# Altium project ESP32_INDUSTRIAL_IO_BASEBOARD.PrjPcb (part 2 of 2)

## Sheet EtherCAT.SchDoc
size B
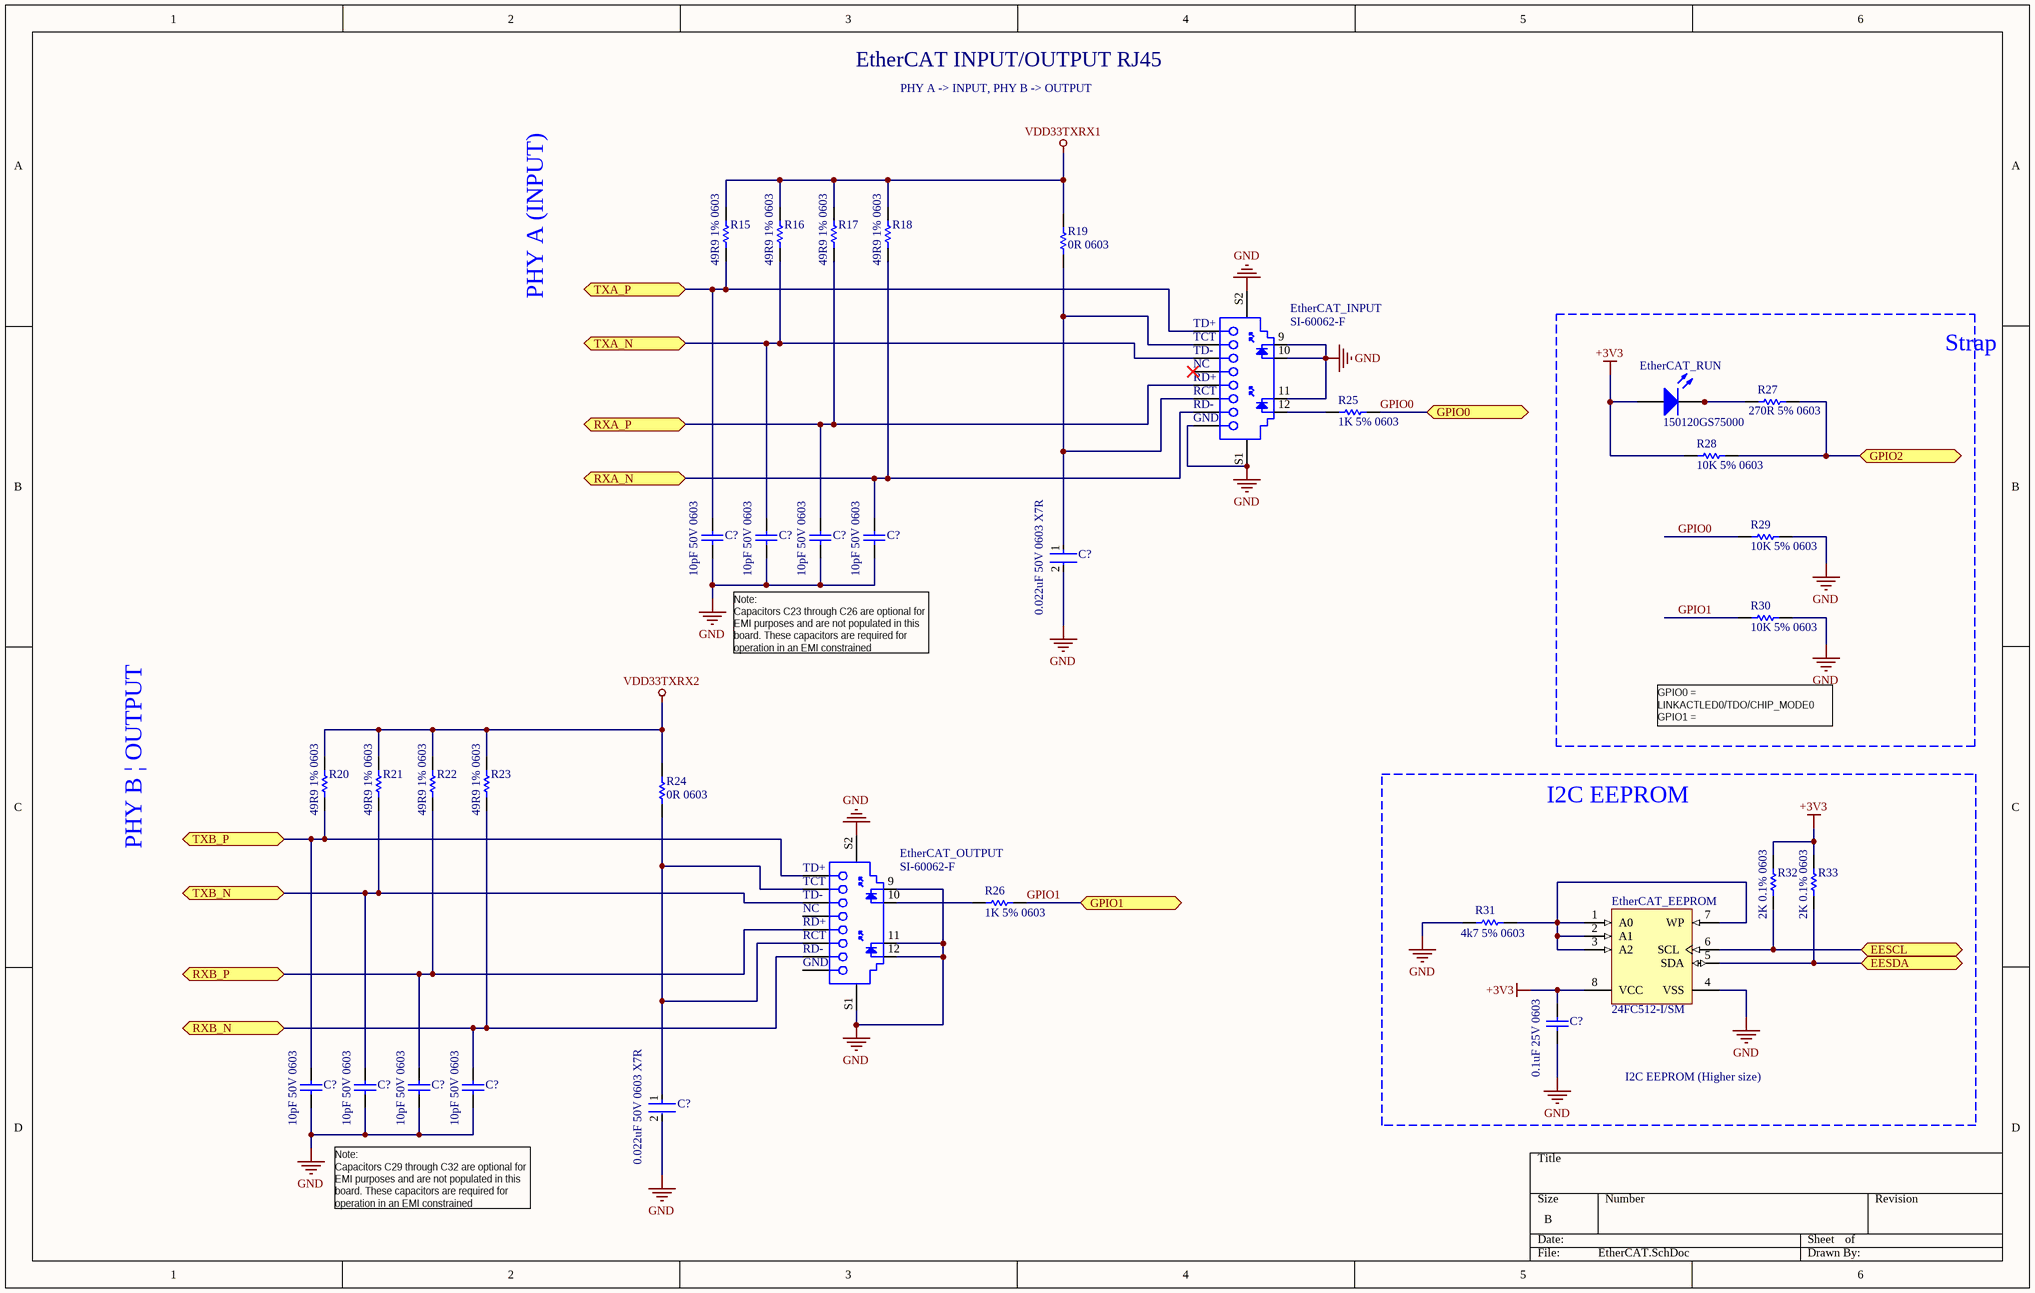
[diagram p5: EtherCAT.SchDoc]

### Parts
(Parts that share a designator on the sheet are numbered #1, #2 ... from top to bottom, then left to right.)
C?#1  10pF 50V 0603  [CAPC1608X90X35LL10T15]
C?#2  10pF 50V 0603  [CAPC1608X90X35LL10T15]
C?#3  10pF 50V 0603  [CAPC1608X90X35LL10T15]
C?#4  10pF 50V 0603  [CAPC1608X90X35LL10T15]
C?#5  0.022uF 50V 0603 X7R  [FP-C0603C-CF-MFG]
C?#6  0.1uF 25V 0603  [CAPC1608X90X35LL10T15]
C?#7  10pF 50V 0603  [CAPC1608X90X35LL10T15]
C?#8  10pF 50V 0603  [CAPC1608X90X35LL10T15]
C?#9  10pF 50V 0603  [CAPC1608X90X35LL10T15]
C?#10  10pF 50V 0603  [CAPC1608X90X35LL10T15]
C?#11  0.022uF 50V 0603 X7R  [FP-C0603C-CF-MFG]
EtherCAT_EEPROM  24FC512-I/SM  [SOIJ-SM8_M]
EtherCAT_INPUT  SI-60062-F  [BELF-SI-60062-F_V]
EtherCAT_OUTPUT  SI-60062-F  [BELF-SI-60062-F_V]
EtherCAT_RUN  150120GS75000  [1206_A]
R15  49R9 1% 0603  [RESC1608X55X25NL10T15]
R16  49R9 1% 0603  [RESC1608X55X25NL10T15]
R17  49R9 1% 0603  [RESC1608X55X25NL10T15]
R18  49R9 1% 0603  [RESC1608X55X25NL10T15]
R19  0R 0603  [RESC1608X55X25ML10T15]
R20  49R9 1% 0603  [RESC1608X55X25NL10T15]
R21  49R9 1% 0603  [RESC1608X55X25NL10T15]
R22  49R9 1% 0603  [RESC1608X55X25NL10T15]
R23  49R9 1% 0603  [RESC1608X55X25NL10T15]
R24  0R 0603  [RESC1608X55X25ML10T15]
R25  1K 5% 0603  [RESC1608X55X25NL10T15]
R26  1K 5% 0603  [RESC1608X55X25NL10T15]
R27  270R 5% 0603  [RESC1608X55X25LL10T15]
R28  10K 5% 0603  [RESC1608X55X25ML10T15]
R29  10K 5% 0603  [RESC1608X55X25ML10T15]
R30  10K 5% 0603  [RESC1608X55X25ML10T15]
R31  4k7 5% 0603  [RESC1608X55X25ML10T15]
R32  2K 0.1% 0603  [RESC1608X55X25ML10T15]
R33  2K 0.1% 0603  [RESC1608X55X25ML10T15]

### Blocks framed on the sheet
Strap: EtherCAT_RUN R27-R30
I2C EEPROM: C?#6 EtherCAT_EEPROM R31-R33

### Ports
EESCL (bidir), EESDA (bidir), GPIO0 (bidir), GPIO1 (bidir), GPIO2 (bidir), RXA_N (bidir), RXA_P (bidir), RXB_N (bidir), RXB_P (bidir), TXA_N (bidir), TXA_P (bidir), TXB_N (bidir), TXB_P (bidir)

### Nets
+3V3: C?#6.2 EtherCAT_EEPROM.8(VCC) EtherCAT_RUN.2(A) R28.2 R32.2 R33.2
GND: C?#1.1 C?#2.1 C?#3.1 C?#4.1 C?#5.2 C?#6.1 C?#7.1 C?#8.1 C?#9.1 C?#10.1 C?#11.2 EtherCAT_EEPROM.4(VSS) EtherCAT_INPUT.8(GND) EtherCAT_INPUT.9 EtherCAT_INPUT.10 EtherCAT_INPUT.11 EtherCAT_INPUT.S1 EtherCAT_INPUT.S2 EtherCAT_OUTPUT.9 EtherCAT_OUTPUT.11 EtherCAT_OUTPUT.12 EtherCAT_OUTPUT.S1 EtherCAT_OUTPUT.S2 R29.1 R30.1 R31.1
VDD33TXRX1: R15.2 R16.2 R17.2 R18.2 R19.2
VDD33TXRX2: R20.2 R21.2 R22.2 R23.2 R24.2
GPIO0: R25.2 R29.2 ; port GPIO0
GPIO1: R26.2 R30.2 ; port GPIO1
RXA_N: C?#4.2 EtherCAT_INPUT.7(RD-) R18.1 ; port RXA_N
RXA_P: C?#3.2 EtherCAT_INPUT.5(RD+) R17.1 ; port RXA_P
RXB_N: C?#10.2 EtherCAT_OUTPUT.7(RD-) R23.1 ; port RXB_N
RXB_P: C?#9.2 EtherCAT_OUTPUT.5(RD+) R22.1 ; port RXB_P
TXA_N: C?#2.2 EtherCAT_INPUT.3(TD-) R16.1 ; port TXA_N
TXA_P: C?#1.2 EtherCAT_INPUT.1(TD+) R15.1 ; port TXA_P
TXB_N: C?#8.2 EtherCAT_OUTPUT.3(TD-) R21.1 ; port TXB_N
TXB_P: C?#7.2 EtherCAT_OUTPUT.1(TD+) R20.1 ; port TXB_P
NetC?#5_1: C?#5.1 EtherCAT_INPUT.2(TCT) EtherCAT_INPUT.6(RCT) R19.1
NetC?#11_1: C?#11.1 EtherCAT_OUTPUT.2(TCT) EtherCAT_OUTPUT.6(RCT) R24.1
NetEtherCAT_EEPROM_1: EtherCAT_EEPROM.1(A0) EtherCAT_EEPROM.2(A1) EtherCAT_EEPROM.3(A2) EtherCAT_EEPROM.7(WP) R31.2
NetEtherCAT_EEPROM_5: EtherCAT_EEPROM.5(SDA) R33.1 ; port EESDA
NetEtherCAT_EEPROM_6: EtherCAT_EEPROM.6(SCL) R32.1 ; port EESCL
NetEtherCAT_INPUT_12: EtherCAT_INPUT.12 R25.1
NetEtherCAT_OUTPUT_10: EtherCAT_OUTPUT.10 R26.1
NetEtherCAT_RUN_1: EtherCAT_RUN.1(K) R27.1
NetR27_2: R27.2 R28.1 ; port GPIO2

Not connected (* = marked no-connect by the designer): EtherCAT_INPUT 4(NC)*; EtherCAT_OUTPUT 4(NC) 8(GND)

### Notes on the sheet
- EtherCAT INPUT/OUTPUT RJ45
- PHY A -> INPUT, PHY B -> OUTPUT
- PHY A (INPUT)
- (near C?#2) Note:
  Capacitors C23 through C26 are optional for EMI purposes and are not populated in this  board. These capacitors are required for operation in an EMI constrained environment.
- GPIO0 = LINKACTLED0/TDO/CHIP_MODE0
  GPIO1 = LINKACTLED1/TDI/CHIP_MODE1
  GPIO2 = RUNLED/E2PSIZE
- PHY B | OUTPUT
- I2C EEPROM (Higher size)
- (near C?#8) Note:
  Capacitors C29 through C32 are optional for EMI purposes and are not populated in this  board. These capacitors are required for operation in an EMI constrained environment.

### Library data of the parts
C?#1-C?#4 C?#7-C?#10 = CMP-2006-02592-1: Part Number: GRM1885C1H100JA01D; Manufacturer: Murata
C?#5 C?#11 = CMP-2006-03879-3: Ceramic Capacitor 0.022Uf 50V, X7R, 10%, 0603, Full Reel; Manufacturer Part Number: C0603C223K5RACTU; Manufacturer: KEMET; Automotive Grade: Grade 1; Capacitance: 22,000 pF; Value: 22,000 pF; Tolerance: 0.1; Temperature Coefficient: 30ppm/°C; Material: Ceramic; Mouser Description: Capacitor; Ceramic; Cap; .022uF; Tol+10%; SMT; Vol-Rtg 50V; X7R; TR; Voltage Rating: 50 V; Category: Cap; Device Class L2: Capacitors; RoHS: TRUE; Package: C0603C-CF; Device Class L1: Passive Components; Temperature Range Low: -55°C; Octopart: https://octopart.com/c0603c223k5ractu-kemet-97352; Temperature: -55°C to +125°C; Temperature Range High: +125°C; Automotive: Yes; Lead Free: Yes; ComponentLink2URL: https://api.kemet.com/component-edge/download/datasheet/C0603C100J5GACAUTO.pdf; Temperature Characteristic: X7R; Height: 0.87mm; Device Class L3: Ceramic Capacitors; Digikey Description: Ceramic Capacitor 0.022Uf 50V, X7R, 10%, 0603, Full Reel; ComponentLink2Description: Datasheet
C?#6 = CMP-2006-02868-1: Part Number: GRM188R71E104KA01D; Manufacturer: Murata
EtherCAT_EEPROM = CMP-0159-00532-1: 512Kbit, 1MHz, 2.5V, I2C Serial EEPROM, 8-Pin SOIC 208mil, Industrial Temperature; PackageDescription: 8-Lead Plastic Small Outline (SM) - Medium, 5.28 mm Body [SOIJ]; PackageReference: SOIJ-SM8; PackageVersion: revBB, Aug-2009; DatasheetVersion: revJ, Jul-2008
EtherCAT_INPUT EtherCAT_OUTPUT = CMP-2000-07059-1: 1 Port RJ45 Magjack Connector with Yellow and Green LED, 10/100 Base-T, 12-Pin THD, RoHS, Tray; Manufacturer: Bel Fuse; Number of Ways: 8P4C; Gender: Female; Shield Type: STP; Connector Type: RJ45; Contact Plating: Gold; Mounting Type: ThroughHole; Datasheet Version: Rev. B0, 09/2008; Package Reference: SI-60062-F; Manufacturer URL: http://belfuse.com/; Package Description: 12-Pin Through Hole Device, Body 21.59 x 16.13 mm; Series: MagJack; Contact Material: CopperAlloy; Datasheet URL: http://belfuse.com/pdfs/SI-60062-F.pdf; Width: 17.98mm; Length: 15.21mm; Mounting Technology: ThroughHole; Depth: 21.59mm; Orientation: Straight
EtherCAT_RUN = CMP-1426-00014-1: SMD mono-color Chip LED, WL-SMCW, Green; Manufacturer: Wuerth Elektronik; PackageReference: 1206_A; PartNumber: 150120GS75000; ComponentLink1Description: Manufacturer URL; ComponentLink2URL: http://katalog.we-online.com/led/datasheet/150120GS75000.pdf; ComponentLink2Description: Datasheet; Color: Green; ComponentLink1URL: http://www.we-online.com
R15-R18 R20-R23 = CMP-1659-00036-1: General Purpose Chip Resistor, 49.9 Ohm, +/- 1%, -55 to 155 degC, 0603 (1608 Metric), RoHS, Tape and Reel; Max Supply Voltage: 3.63 V; Case\Package: LQFP; Interface: SPI; Min Supply Voltage: 2.97 V; PackageReference: 0603; Packaging: Tray; ComponentLink2Description: Datasheet; ComponentLink1Description: Manufacturer URL; ComponentLink2URL: https://datasheet.ciiva.com/11808/0900766b80f96399-11808223.pdf; RoHSCompliant: true; Max Operating Temperature: 85 degC; ComponentLink1URL: http://www.yageo.com/; PackageDescription: 2-Pin Surface Mount Device, Body 1.6 x 0.8 mm; DatasheetVersion: Rev. 4, 04/2009; Min Operating Temperature: -40 degC; Package Quantity: 250; Pins: 48
R19 R24 = CMP-2100-03667-1: Chip Resistor, 0 Ohm, +/- 5%, 0.1 W, -55 to 155 degC, 0603 (1608 Metric), RoHS, Tape and Reel; Manufacturer: Yageo; Temperature Coefficient: 200ppm/degreesC; Voltage Rating: 50V; Power Rating: 100mW; Resistance: 0mOhm; Width: 0.8mm; Max Operating Temperature: 155degC; Tolerance: 5%; Package Reference: 0603; Height: 0.45mm; Depth: 0.8mm; Package Description: 2-Pin Surface Mount Device, Body 1.6 x 0.8 mm; Termination: SMD/SMT; Package Quantity: 5000; Case/Package: 0603; Case Code (Imperial): 0603; Radiation Hardening: No; Number of Pins: 2; Length: 1.6mm; Lead Free: LeadFree; Voltage Rating (DC): 50V; Military Standard: Not; Datasheet URL: http://www.yageo.com/NewPortal/yageodocoutput?fileName=/pdf/R-Chip/PYu-RC_Group_51_RoHS_L_5.pdf; Manufacturer URL: http://www.yageo.com/; Packaging: TapeandReel; Case Code (Metric): 1608; Min Operating Temperature: -55degC; Composition: ThickFilm; RoHSCompliant: true; Contact Plating: Tin; Datasheet Version: Rev. 5, 10/2016; REACH SVHC: NoSVHC
R25 R26 = CMP-1659-00009-4: Chip Resistor, 1 KOhm, +/-1%, 0.1 W, -55 to 155 degC, 0603 (1608 Metric), RoHS, Tape and Reel; Manufacturer: Yageo; Voltage Rating: 50 V; ComponentLink2URL: http://www.yageo.com/documents/recent/PYu-RC_Group_51_RoHS_L_04.pdf; Max Operating Temperature: 155 degC; PackageDescription: 2-Pin Surface Mount Device, Body 1.6 x 0.8 mm; Packaging: Tape and Reel; ComponentLink3Description: Package Specification; REACH SVHC: No SVHC; Mount: Surface Mount; ComponentLink2Description: Datasheet; Length: 1.6 mm; PackageReference: 0603; Height: 0.45 mm; DatasheetVersion: Rev. 4, 02/2016; Min Operating Temperature: -55 degC; ComponentLink1Description: Manufacturer URL; Package Quantity: 200; RoHSCompliant: true; ComponentLink3URL: http://www.farnell.com/datasheets/443971.pdf; Pins: 2; Mounting Technology: Surface Mount; ComponentLink1URL: http://www.yageo.com/
R27 = CMP-2000-06956-1: Chip Resistor, 270 Ohm, +/- 5%, 0.1 W, -55 to 155 degC, 0603 (1608 Metric), RoHS, Tape and Reel; Manufacturer: Yageo; Resistor Case Style: 0603[1608Metric]; Resistance: 270ohm; Resistor Element Type: ThickFilm; Voltage Rating: 50V; Temperature Coefficient: ±100ppm/°C; SVHC: ToBeAdvised; Product Range: RCSeries; Power Rating: 100mW; MSL: MSL1-Unlimited; Datasheet URL: http://www.yageo.com/documents/recent/PYu-RC_Group_51_RoHS_L_7.pdf; Packaging: CutTape; Manufacturer URL: http://www.yageo.com/; Automotive Qualification Standard: -; Resistance Tolerance: ±5%; Package Reference: 0603; Package Description: 2-Pin Surface Mount Device, Body 1.6 x 0.8 mm; Mounting Technology: SurfaceMount; Datasheet Version: Rev. 7, 05/2017
R28-R30 = CMP-2100-03664-1: Chip Resistor, 10 KOhm, +/- 1%, 01 W, -55 to 155 degC, 0603 (1608 Metric), RoHS, Tape and Reel; Manufacturer: Yageo; Temperature Coefficient: 100ppm/degreesC; Resistance: 10KOhm; Voltage Rating: 75V; Power Rating: 100mW; Voltage Rating (DC): 50V; Composition: ThickFilm; RoHSCompliant: true; Height: 0.45mm; Lead Free: LeadFree; Case Code (Metric): 1608; Case/Package: 0603; Datasheet Version: Rev. 5, 10/2016; Package Reference: 0603; Depth: 0.8mm; Package Description: 2-Pin Surface Mount Device, Body 1.6 x 0.8 mm; Case Code (Imperial): 0603; Packaging: TapeandReel; Termination: SMD/SMT; Lead Pitch: 0.3mm; Width: 0.8mm; Number of Pins: 2; Length: 1.6mm; REACH SVHC: NoSVHC; Military Standard: Not; Max Operating Temperature: 155degC; Min Operating Temperature: -55degC; Manufacturer URL: http://www.yageo.com/; Datasheet URL: http://www.yageo.com/NewPortal/yageodocoutput?fileName=/pdf/R-Chip/PYu-RC_Group_51_RoHS_L_5.pdf; Weight: 7.1E-05oz; Tolerance: 1%
R31 = CMP-2000-05024-1: Chip Resistor, 4.7 KOhm, +/- 5%, 100 mW, -55 to 155 degC, 0603 (1608 Metric), RoHS, Tape and Reel; Manufacturer: Yageo; Resistance: 4.7kOhms; Temperature Coefficient: 100PPM/C; Power Rating: 100mW; Voltage Rating: 50V; Operating Temperature Range: -55Cto+155C; Case Code - mm: 1608; Tolerance: 5%; Product: ThickFilmResistorsGeneralPurpose; Case Code - in: 0603; Datasheet URL: http://www.yageo.com/documents/recent/PYu-RC_Group_51_RoHS_L_04.pdf; Package Reference: 603; Datasheet Version: Rev. 4, 02/2016; Package Description: 2-Pin Surface Mount Device, Body 1.6 x 0.8 mm; Manufacturer URL: http://www.yageo.com/; Series: RC; Packaging: Reel; Termination Style: SMD/SMT
R32 R33 = CMP-2000-04430-1: Part Number: RT0603BRD072KL; Manufacturer: Yageo

## Sheet CONN.SchDoc
size B
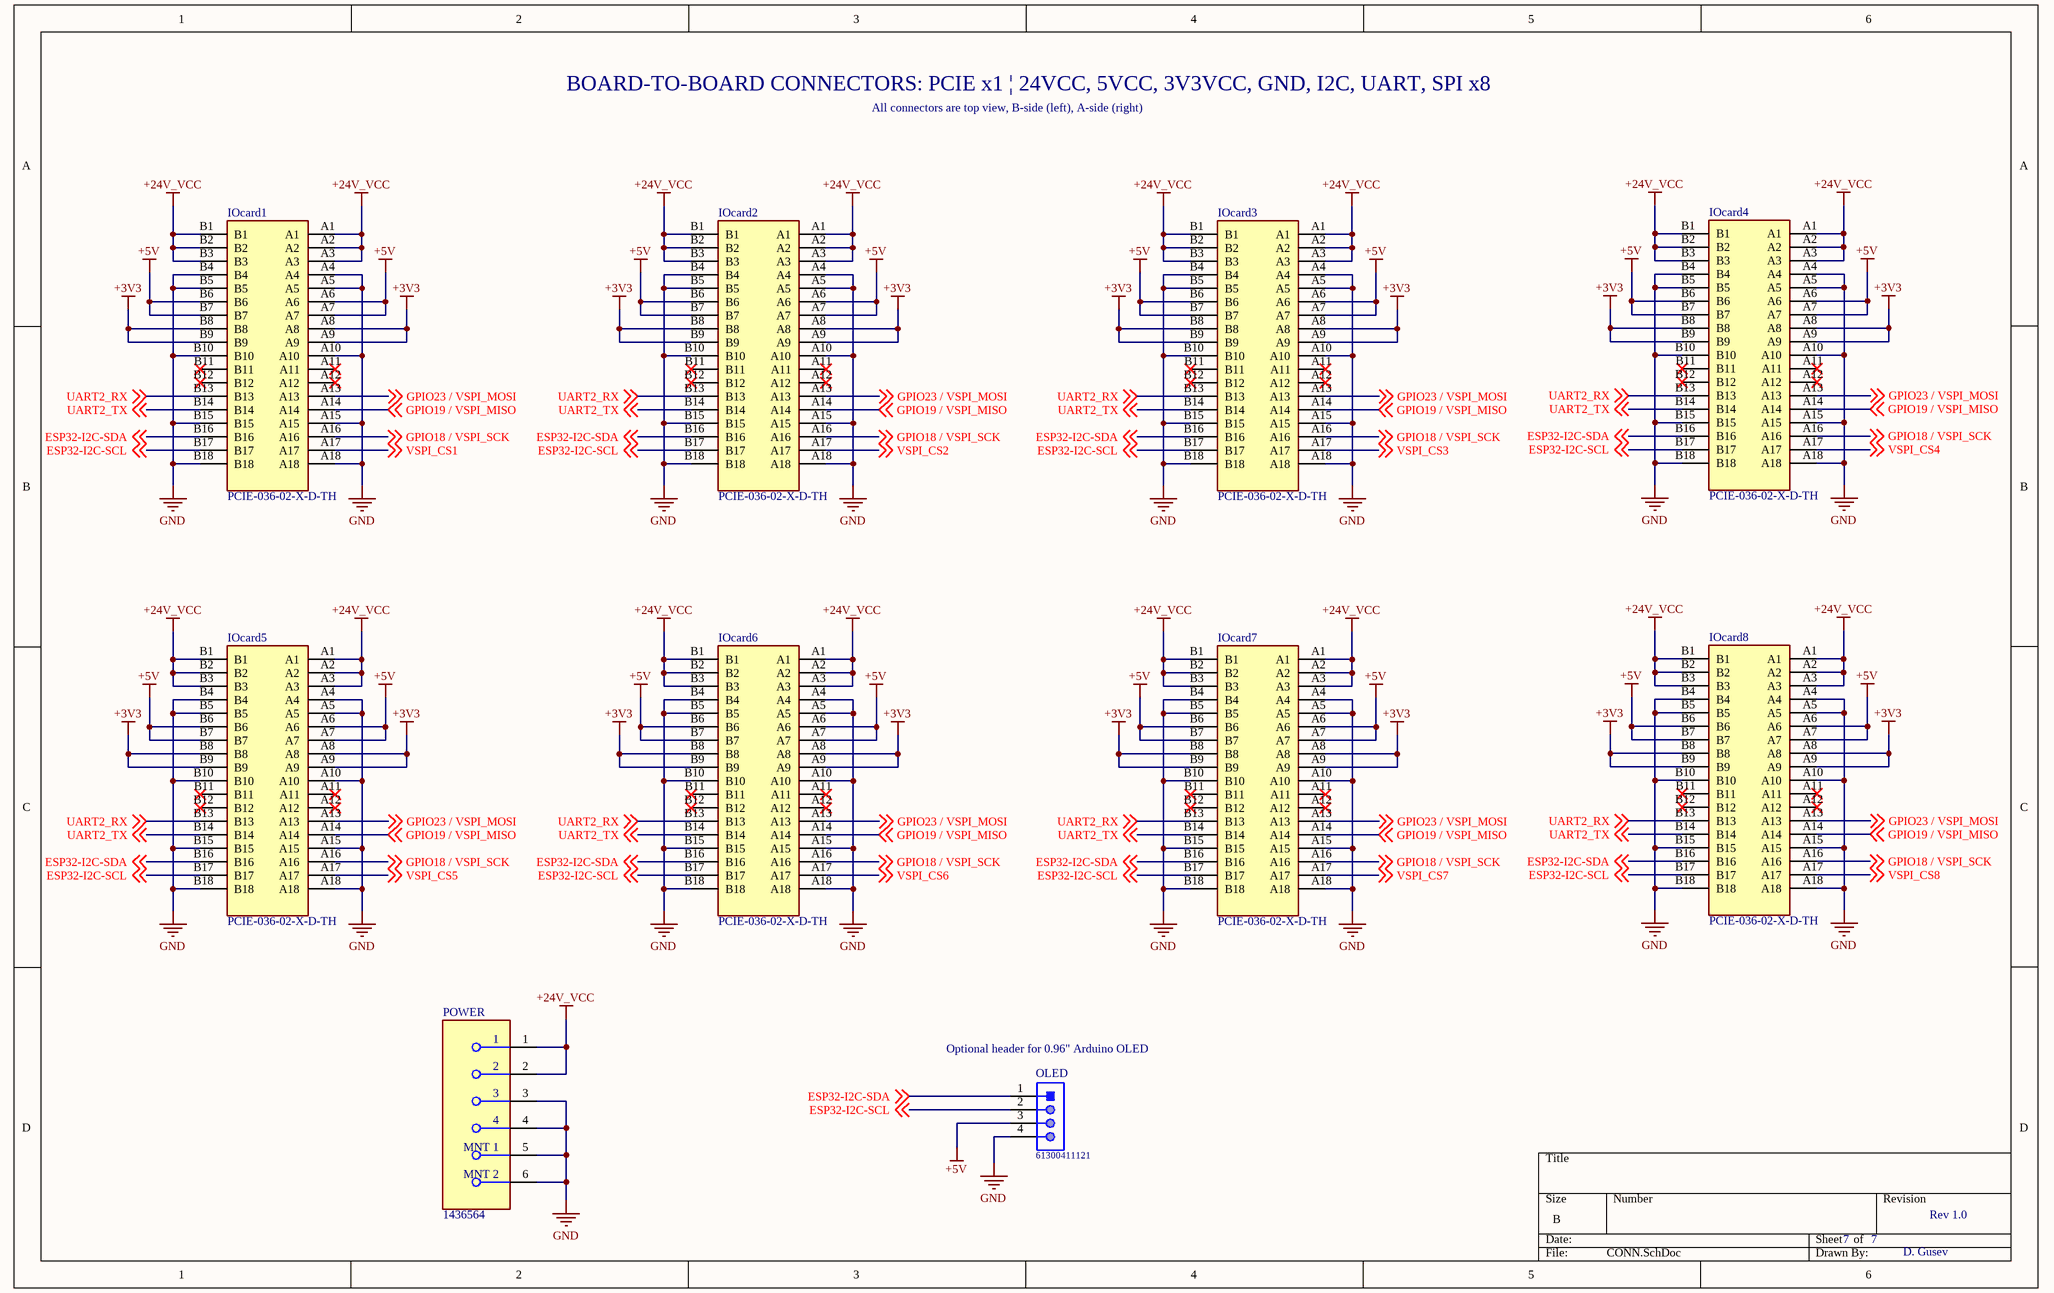
[diagram p6: CONN.SchDoc]

### Parts
IOcard1  PCIE-036-02-X-D-TH  [SAMTEC_PCIE-036-02-X-D-TH]
IOcard2  PCIE-036-02-X-D-TH  [SAMTEC_PCIE-036-02-X-D-TH]
IOcard3  PCIE-036-02-X-D-TH  [SAMTEC_PCIE-036-02-X-D-TH]
IOcard4  PCIE-036-02-X-D-TH  [SAMTEC_PCIE-036-02-X-D-TH]
IOcard5  PCIE-036-02-X-D-TH  [SAMTEC_PCIE-036-02-X-D-TH]
IOcard6  PCIE-036-02-X-D-TH  [SAMTEC_PCIE-036-02-X-D-TH]
IOcard7  PCIE-036-02-X-D-TH  [SAMTEC_PCIE-036-02-X-D-TH]
IOcard8  PCIE-036-02-X-D-TH  [SAMTEC_PCIE-036-02-X-D-TH]
OLED  61300411121  [61300411121]
POWER  1436564  [FP-1436564-MFG]

### Nets
+3V3: IOcard1.A8 IOcard1.A9 IOcard1.B8 IOcard1.B9 IOcard2.A8 IOcard2.A9 IOcard2.B8 IOcard2.B9 IOcard3.A8 IOcard3.A9 IOcard3.B8 IOcard3.B9 IOcard4.A8 IOcard4.A9 IOcard4.B8 IOcard4.B9 IOcard5.A8 IOcard5.A9 IOcard5.B8 IOcard5.B9 IOcard6.A8 IOcard6.A9 IOcard6.B8 IOcard6.B9 IOcard7.A8 IOcard7.A9 IOcard7.B8 IOcard7.B9 IOcard8.A8 IOcard8.A9 IOcard8.B8 IOcard8.B9
+5V: IOcard1.A6 IOcard1.A7 IOcard1.B6 IOcard1.B7 IOcard2.A6 IOcard2.A7 IOcard2.B6 IOcard2.B7 IOcard3.A6 IOcard3.A7 IOcard3.B6 IOcard3.B7 IOcard4.A6 IOcard4.A7 IOcard4.B6 IOcard4.B7 IOcard5.A6 IOcard5.A7 IOcard5.B6 IOcard5.B7 IOcard6.A6 IOcard6.A7 IOcard6.B6 IOcard6.B7 IOcard7.A6 IOcard7.A7 IOcard7.B6 IOcard7.B7 IOcard8.A6 IOcard8.A7 IOcard8.B6 IOcard8.B7 OLED.3
+24V_VCC: IOcard1.A1 IOcard1.A2 IOcard1.A3 IOcard1.B1 IOcard1.B2 IOcard1.B3 IOcard2.A1 IOcard2.A2 IOcard2.A3 IOcard2.B1 IOcard2.B2 IOcard2.B3 IOcard3.A1 IOcard3.A2 IOcard3.A3 IOcard3.B1 IOcard3.B2 IOcard3.B3 IOcard4.A1 IOcard4.A2 IOcard4.A3 IOcard4.B1 IOcard4.B2 IOcard4.B3 IOcard5.A1 IOcard5.A2 IOcard5.A3 IOcard5.B1 IOcard5.B2 IOcard5.B3 IOcard6.A1 IOcard6.A2 IOcard6.A3 IOcard6.B1 IOcard6.B2 IOcard6.B3 IOcard7.A1 IOcard7.A2 IOcard7.A3 IOcard7.B1 IOcard7.B2 IOcard7.B3 IOcard8.A1 IOcard8.A2 IOcard8.A3 IOcard8.B1 IOcard8.B2 IOcard8.B3 POWER.1 POWER.2
GND: IOcard1.A4 IOcard1.A5 IOcard1.A10 IOcard1.A15 IOcard1.A18 IOcard1.B4 IOcard1.B5 IOcard1.B10 IOcard1.B15 IOcard1.B18 IOcard2.A4 IOcard2.A5 IOcard2.A10 IOcard2.A15 IOcard2.A18 IOcard2.B4 IOcard2.B5 IOcard2.B10 IOcard2.B15 IOcard2.B18 IOcard3.A4 IOcard3.A5 IOcard3.A10 IOcard3.A15 IOcard3.A18 IOcard3.B4 IOcard3.B5 IOcard3.B10 IOcard3.B15 IOcard3.B18 IOcard4.A4 IOcard4.A5 IOcard4.A10 IOcard4.A15 IOcard4.A18 IOcard4.B4 IOcard4.B5 IOcard4.B10 IOcard4.B15 IOcard4.B18 IOcard5.A4 IOcard5.A5 IOcard5.A10 IOcard5.A15 IOcard5.A18 IOcard5.B4 IOcard5.B5 IOcard5.B10 IOcard5.B15 IOcard5.B18 IOcard6.A4 IOcard6.A5 IOcard6.A10 IOcard6.A15 IOcard6.A18 IOcard6.B4 IOcard6.B5 IOcard6.B10 IOcard6.B15 IOcard6.B18 IOcard7.A4 IOcard7.A5 IOcard7.A10 IOcard7.A15 IOcard7.A18 IOcard7.B4 IOcard7.B5 IOcard7.B10 IOcard7.B15 IOcard7.B18 IOcard8.A4 IOcard8.A5 IOcard8.A10 IOcard8.A15 IOcard8.A18 IOcard8.B4 IOcard8.B5 IOcard8.B10 IOcard8.B15 IOcard8.B18 OLED.4 POWER.3 POWER.4 POWER.5(MNT_1) POWER.6(MNT_2)
ESP32-I2C-SCL: IOcard1.B17 IOcard2.B17 IOcard3.B17 IOcard4.B17 IOcard5.B17 IOcard6.B17 IOcard7.B17 IOcard8.B17 OLED.2 ; off-sheet ESP32-I2C-SCL
ESP32-I2C-SDA: IOcard1.B16 IOcard2.B16 IOcard3.B16 IOcard4.B16 IOcard5.B16 IOcard6.B16 IOcard7.B16 IOcard8.B16 OLED.1 ; off-sheet ESP32-I2C-SDA
GPIO18 / VSPI_SCK: IOcard1.A16 IOcard2.A16 IOcard3.A16 IOcard4.A16 IOcard5.A16 IOcard6.A16 IOcard7.A16 IOcard8.A16 ; off-sheet GPIO18 / VSPI_SCK
GPIO19 / VSPI_MISO: IOcard1.A14 IOcard2.A14 IOcard3.A14 IOcard4.A14 IOcard5.A14 IOcard6.A14 IOcard7.A14 IOcard8.A14 ; off-sheet GPIO19 / VSPI_MISO
GPIO23 / VSPI_MOSI: IOcard1.A13 IOcard2.A13 IOcard3.A13 IOcard4.A13 IOcard5.A13 IOcard6.A13 IOcard7.A13 IOcard8.A13 ; off-sheet GPIO23 / VSPI_MOSI
UART2_RX: IOcard1.B13 IOcard2.B13 IOcard3.B13 IOcard4.B13 IOcard5.B13 IOcard6.B13 IOcard7.B13 IOcard8.B13 ; off-sheet UART2_RX
UART2_TX: IOcard1.B14 IOcard2.B14 IOcard3.B14 IOcard4.B14 IOcard5.B14 IOcard6.B14 IOcard7.B14 IOcard8.B14 ; off-sheet UART2_TX
VSPI_CS1: IOcard1.A17 ; off-sheet VSPI_CS1
VSPI_CS2: IOcard2.A17 ; off-sheet VSPI_CS2
VSPI_CS3: IOcard3.A17 ; off-sheet VSPI_CS3
VSPI_CS4: IOcard4.A17 ; off-sheet VSPI_CS4
VSPI_CS5: IOcard5.A17 ; off-sheet VSPI_CS5
VSPI_CS6: IOcard6.A17 ; off-sheet VSPI_CS6
VSPI_CS7: IOcard7.A17 ; off-sheet VSPI_CS7
VSPI_CS8: IOcard8.A17 ; off-sheet VSPI_CS8

Not connected (* = marked no-connect by the designer): IOcard1 A11* A12* B11* B12*; IOcard2 A11* A12* B11* B12*; IOcard3 A11* A12* B11* B12*; IOcard4 A11* A12* B11* B12*; IOcard5 A11* A12* B11* B12*; IOcard6 A11* A12* B11* B12*; IOcard7 A11* A12* B11* B12*; IOcard8 A11* A12* B11* B12*

### Notes on the sheet
- BOARD-TO-BOARD CONNECTORS: PCIE x1 | 24VCC, 5VCC, 3V3VCC, GND, I2C, UART, SPI x8
- All connectors are top view, B-side (left), A-side (right)
- (near OLED) Optional header for 0.96" Arduino OLED
- 7
- Rev 1.0
- D. Gusev

### Library data of the parts
IOcard1-IOcard8 = PCIE-036-02-X-D-TH: 1.00 mm PCI ExpressÂ® Edge Card Connector; MF: Samtec; Value: *; Availability: Unavailable; Package: None; MP: PCIE-036-02-X-D-TH; Price: None
OLED = CMP-1502-01064-1: THT Vertical Pin Header WR-PHD, Pitch 2.54 mm, Single Row, 4 pins; Manufacturer: Wurth Elektronik; Withstanding Voltage: 500VAC; Rated Current: 3A; Working Voltage: 250VAC; Pin Number: 4; Gender: Male; Contact Resistance: 20mOhm; Pitch: 2.54mm; Manufacturer URL: http://www.we-online.de; Operating Temperature: -40to105degC; Packaging: Bag; Mounting Technology: THT; Package Reference: 61300411121; Datasheet URL: https://katalog.we-online.de/em/datasheet/6130xx11121.pdf; Publisher: WurthElektronik; Part Number: 61300411121; Row Number: Single; Orientation: Vertical
POWER = CMP-09396-000001-1: CONN RCPT FMALE 4POS GOLD SOLDER; Manufacturer: Phoenix Contact; Conn Orientation: Right Angle; Is Female: yes; Current Rating: 4A; Description: Circular Metric Connectors FEMALE 4P A-CODED; Voltage Rating: 250V; Shielding: true; Number Of Contacts: 4; Pitch: 3.54mm; Conn Gender: Female; Device Class L2: Circular Connectors; Temperature Range Low: -25°C; Device Class L3: unset; Device Class L1: Connectors; Ambient Temperature Range Low: -25°C; Octopart: https://octopart.com/1436564-phoenix+contact-12805506; Category: Conn; Package: 1436564; Lead Free: Yes; RoHS: TRUE; Height: 16.4mm; Mouser Description: Circular Metric Connectors FEMALE 4P A-CODED; Automotive: No; Manufacturer Part Number: 1436564; Contact Material: Gold; ComponentLink2URL: https://www.phoenixcontact.com/online/portal/pi/?uri=pxc-oc-itemdetail:pid=1436564&library=pies&pcck=P-18-03-01&tab=1&selectedCategory=ALL; Temperature Range High: +85°C; Ambient Temperature Range High: +85°C; Digikey Description: CONN RCPT FMALE 4POS GOLD SOLDER; Temperature: -25°C to +85°C; ComponentLink2Description: Datasheet

## Nets that join several sheets
+3V3: USB-ESP32 (6 pins), ESP32 (C7.2 ESP32.2 R10.2 R11.2), LAN9252-1 (17 pins), LAN9252-2 (DEBUG.5 DEBUG.6), EtherCAT (6 pins), CONN (32 pins)
+5V: USB-ESP32 (8 pins), LAN9252-2 (DEBUG.3 DEBUG.4), CONN (33 pins)
+5VDD: VOLT_REGULATION (C43.2 L1.2 R7.1 U3.4), USB-ESP32 (D2.2)
+24V_VCC: VOLT_REGULATION (C42.2 U3.1), CONN (50 pins)
GND: VOLT_REGULATION (7 pins), USB-ESP32 (21 pins), ESP32 (7 pins), LAN9252-1 (30 pins), LAN9252-2 (DEBUG.39 DEBUG.40), EtherCAT (26 pins), CONN (85 pins)
VDD33TXRX1: LAN9252-1 (C8.2 C9.2 FB1.2 LAN9252.51), EtherCAT (5 pins)
VDD33TXRX2: LAN9252-1 (C10.2 C11.2 FB2.2 LAN9252.64), EtherCAT (5 pins)
ESP32-I2C-SCL: ESP32 (ESP32.36), CONN (9 pins)
ESP32-I2C-SDA: ESP32 (ESP32.33), CONN (9 pins)
ESP32_RX: USB-ESP32 (U1.20), ESP32 (ESP32.34)
ESP32_TX: USB-ESP32 (U1.4), ESP32 (ESP32.35)
GPIO0: USB-ESP32 (Q2.3), ESP32 (ESP32.25 ESP32_BOOT.2 R11.1)
GPIO18 / VSPI_SCK: ESP32 (ESP32.30), LAN9252-2 (DEBUG.10 SCK.3), CONN (8 pins)
GPIO19 / VSPI_MISO: ESP32 (ESP32.31), LAN9252-2 (DEBUG.12 MISO.3), CONN (8 pins)
GPIO23 / VSPI_MOSI: ESP32 (ESP32.37), LAN9252-2 (DEBUG.38 MOSI.3), CONN (8 pins)
IRQ: LAN9252-1 (LAN9252.44), LAN9252-2 (DEBUG.26)
NetEtherCAT_EEPROM_5: LAN9252-1 (LAN9252.42), EtherCAT (EtherCAT_EEPROM.5 R33.1)
NetEtherCAT_EEPROM_6: LAN9252-1 (LAN9252.43), EtherCAT (EtherCAT_EEPROM.6 R32.1)
RESET: USB-ESP32 (Q1.3), ESP32 (ESP32.3 ESP32_RESET.2 R10.1)
RXA_N: LAN9252-1 (LAN9252.54), EtherCAT (C?#4.2 EtherCAT_INPUT.7 R18.1)
RXA_P: LAN9252-1 (LAN9252.55), EtherCAT (C?#3.2 EtherCAT_INPUT.5 R17.1)
RXB_N: LAN9252-1 (LAN9252.61), EtherCAT (C?#10.2 EtherCAT_OUTPUT.7 R23.1)
RXB_P: LAN9252-1 (LAN9252.60), EtherCAT (C?#9.2 EtherCAT_OUTPUT.5 R22.1)
TXA_N: LAN9252-1 (LAN9252.52), EtherCAT (C?#2.2 EtherCAT_INPUT.3 R16.1)
TXA_P: LAN9252-1 (LAN9252.53), EtherCAT (C?#1.2 EtherCAT_INPUT.1 R15.1)
TXB_N: LAN9252-1 (LAN9252.63), EtherCAT (C?#8.2 EtherCAT_OUTPUT.3 R21.1)
TXB_P: LAN9252-1 (LAN9252.62), EtherCAT (C?#7.2 EtherCAT_OUTPUT.1 R20.1)
UART2_RX: ESP32 (ESP32.27), CONN (8 pins)
UART2_TX: ESP32 (ESP32.28), CONN (8 pins)
VSPI_CS1: ESP32 (VSPI_CS1.2), CONN (IOcard1.A17)
VSPI_CS2: ESP32 (VSPI_CS2.2), CONN (IOcard2.A17)
VSPI_CS3: ESP32 (VSPI_CS3.2), CONN (IOcard3.A17)
VSPI_CS4: ESP32 (VSPI_CS4.2), CONN (IOcard4.A17)
VSPI_CS5: ESP32 (VSPI_CS5.2), CONN (IOcard5.A17)
VSPI_CS6: ESP32 (VSPI_CS6.2), CONN (IOcard6.A17)
VSPI_CS7: ESP32 (VSPI_CS7.2), CONN (IOcard7.A17)
VSPI_CS8: ESP32 (VSPI_CS8.2), CONN (IOcard8.A17)
VSPI_CS_LAN9252: ESP32 (CS5.2 CS33.2), LAN9252-2 (CS.3 DEBUG.36)